# Altium project Multi LT circuit.PrjPcb
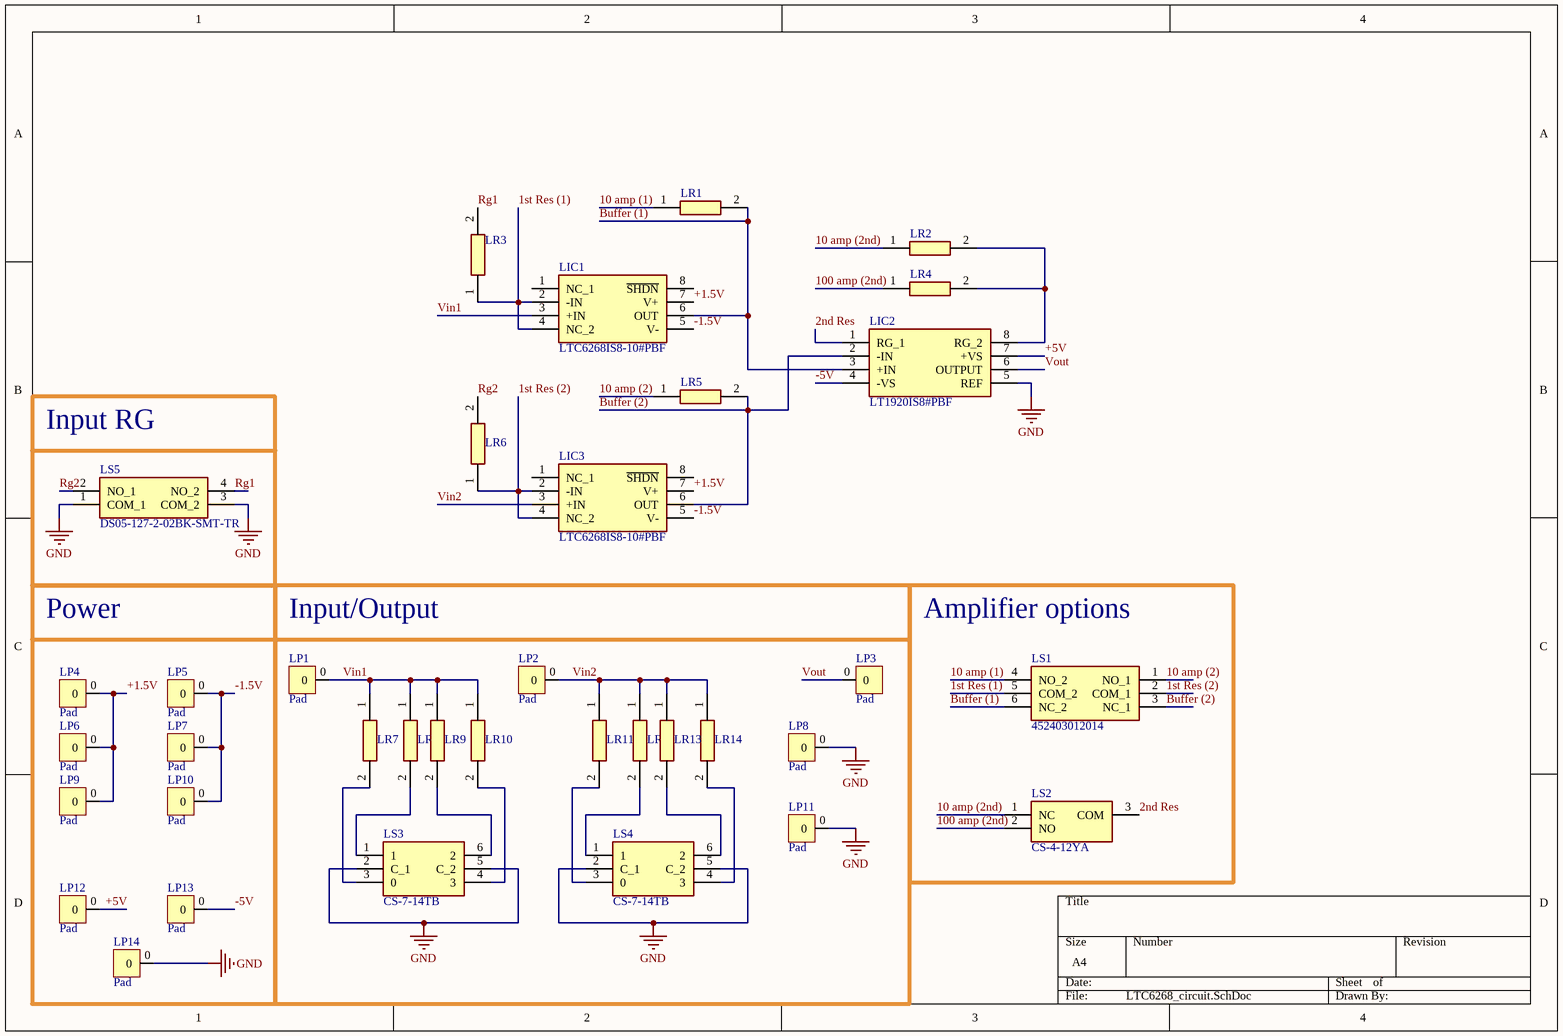
[diagram p0: LTC6268_circuit.SchDoc]
3 sheets, 189 parts. Net scope: global (net labels, ports and power ports of the same name join across sheets).
Board files: LTC6268_PCB.PcbDoc, Multi_LT_PCB.PcbDoc, AD8065_PCB.PcbDoc, Panelize_PCB.PcbDoc
Sheets:
  LTC6268_circuit.SchDoc
  Multi_LT_circuit.SchDoc
  AD8065_circuit.SchDoc

## Sheet LTC6268_circuit.SchDoc
size A4; SheetNumber: 1; SheetTotal: 1

### Parts
LIC1  LTC6268IS8-10#PBF  [SOIC127P599X175-8N]
LIC2  LT1920IS8#PBF  [SOIC127P599X175-8N]
LIC3  LTC6268IS8-10#PBF  [SOIC127P599X175-8N]
LP1  Pad  [Pad]
LP2  Pad  [Pad]
LP3  Pad  [Pad]
LP4  Pad  [Pad]
LP5  Pad  [Pad]
LP6  Pad  [Pad]
LP7  Pad  [Pad]
LP8  Pad  [Pad]
LP9  Pad  [Pad]
LP10  Pad  [Pad]
LP11  Pad  [Pad]
LP12  Pad  [Pad]
LP13  Pad  [Pad]
LP14  Pad  [Pad]
LR1  CRG0805F270R  [RESC2012X65N]  (value not drawn)
LR2  CRG0805F4K7  [RESC2012X65N]  (value not drawn)
LR3  ERJ-HP6F20R0V  [ERJHP6D1000V]  (value not drawn)
LR4  CRG0805F330R  [RESC2012X65N]  (value not drawn)
LR5  CRG0805F270R  [RESC2012X65N]  (value not drawn)
LR6  ERJ-HP6F20R0V  [ERJHP6D1000V]  (value not drawn)
LR7  RH73X2A10GNTN  [RESC2013X50N]  (value not drawn)
LR8  RH73X2A50GNTN  [RESC2013X50N]  (value not drawn)
LR9  RH73H2A100MKTN  [RESC2013X50N]  (value not drawn)
LR10  RH73W2A1GNTN  [RESC2013X50N]  (value not drawn)
LR11  RH73X2A50GNTN  [RESC2013X50N]  (value not drawn)
LR12  RH73X2A10GNTN  [RESC2013X50N]  (value not drawn)
LR13  RH73W2A1GNTN  [RESC2013X50N]  (value not drawn)
LR14  RH73H2A100MKTN  [RESC2013X50N]  (value not drawn)
LS1  452403012014  [452403012014]
LS2  CS-4-12YA  [CS412YA]
LS3  CS-7-14TB  [SOP254P1000X405-6N]
LS4  CS-7-14TB  [SOP254P1000X405-6N]
LS5  DS05-127-2-02BK-SMT-TR  [DS05127202BKSMTTR]

### Blocks framed on the sheet
Input RG: LS5
Power: LP4-LP7 LP9 LP10 LP12-LP14
Input/Output: LP1-LP3 LP8 LP11 LR7-LR14 LS3 LS4
Amplifier options: LS1 LS2

### Nets
GND: LIC2.5(REF) LP8.0 LP11.0 LP14.0 LS3.2(C_1) LS3.5(C_2) LS4.2(C_1) LS4.5(C_2) LS5.1(COM_1) LS5.3(COM_2)
1st Res (1): LIC1.2(-IN) LIC1.4(NC_2) LR3.1 LS1.5(COM_2)
1st Res (2): LIC3.2(-IN) LIC3.4(NC_2) LR6.1 LS1.2(COM_1)
2nd Res: LIC2.1(RG_1) LS2.3(COM)
10 amp (1): LR1.1 LS1.4(NO_2)
10 amp (2): LR5.1 LS1.1(NO_1)
10 amp (2nd): LR2.1 LS2.1(NC)
100 amp (2nd): LR4.1 LS2.2(NO)
+1.5V: LIC1.7(V+) LIC3.7(V+) LP4.0 LP6.0 LP9.0
+5V: LIC2.7(+VS) LP12.0
-1.5V: LIC1.5(V-) LIC3.5(V-) LP5.0 LP7.0 LP10.0
-5V: LIC2.4(-VS) LP13.0
Buffer (1): LIC1.6(OUT) LIC2.3(+IN) LR1.2 LS1.6(NC_2)
Buffer (2): LIC2.2(-IN) LIC3.6(OUT) LR5.2 LS1.3(NC_1)
Rg1: LR3.2 LS5.4(NO_2)
Rg2: LR6.2 LS5.2(NO_1)
Vin1: LIC1.3(+IN) LP1.0 LR7.1 LR8.1 LR9.1 LR10.1
Vin2: LIC3.3(+IN) LP2.0 LR11.1 LR12.1 LR13.1 LR14.1
Vout: LIC2.6(OUTPUT) LP3.0
NetLIC2_8: LIC2.8(RG_2) LR2.2 LR4.2
NetLR7_2: LR7.2 LS3.3(0)
NetLR8_2: LR8.2 LS3.1
NetLR9_2: LR9.2 LS3.6(2)
NetLR10_2: LR10.2 LS3.4(3)
NetLR11_2: LR11.2 LS4.3(0)
NetLR12_2: LR12.2 LS4.1
NetLR13_2: LR13.2 LS4.6(2)
NetLR14_2: LR14.2 LS4.4(3)

Not connected (* = marked no-connect by the designer): LIC1 1(NC_1) 8(~{SHDN}); LIC3 1(NC_1) 8(~{SHDN})

### Library data of the parts
LIC1 LIC3 = LTC6268IS8-10#PBF: Integrated Circuit; Manufacturer_Name: Analog Devices; Datasheet Link: https://datasheet.datasheetarchive.com/originals/distributors/Datasheets_SAMA/eb0bf5824ac521a4901f543e1202dae7.pdf; Height: 1.752mm; Manufacturer_Part_Number: LTC6268IS8-10#PBF; Mouser Part Number: 584-LTC6268IS8-10PBF; Mouser Price/Stock: https://www.mouser.co.uk/ProductDetail/Analog-Devices/LTC6268IS8-10PBF?qs=oahfZPh6IAJW%252BkNj5oLlfA%3D%3D; Arrow Part Number: LTC6268IS8-10#PBF; Arrow Price/Stock: https://www.arrow.com/en/products/ltc6268is8-10pbf/analog-devices?region=nac; Case: SOIC-8; Mounting Style: SMD/SMT
LIC2 = LT1920IS8#PBF: Integrated Circuit; Manufacturer_Name: Analog Devices; Datasheet Link: https://datasheet.datasheetarchive.com/originals/distributors/SFDatasheet-4/sf-00091026.pdf; Height: 1.752mm; Manufacturer_Part_Number: LT1920IS8#PBF; Mouser Part Number: 584-LT1920IS8#PBF; Mouser Price/Stock: https://www.mouser.co.uk/ProductDetail/Analog-Devices/LT1920IS8PBF?qs=ytflclh7QUWOSod6PqfjSg%3D%3D; Arrow Part Number: LT1920IS8#PBF; Arrow Price/Stock: https://www.arrow.com/en/products/lt1920is8pbf/analog-devices?region=nac; Case: SOIC-8; Mounting Style: SMD/SMT
LR1 LR5 = CRG0805F270R: Resistor 270; Manufacturer_Name: TE Connectivity; Datasheet Link: http://www.te.com/commerce/DocumentDelivery/DDEController?Action=showdoc&DocId=Customer+Drawing%7F1623109%7FBA%7Fpdf%7FEnglish%7FENG_CD_1623109_BA.pdf%7F1623109-1; Height: 0.65mm; Manufacturer_Part_Number: CRG0805F270R; Mouser Part Number: 279-CRG0805F270R; Mouser Price/Stock: https://www.mouser.com/Search/Refine.aspx?Keyword=279-CRG0805F270R; Arrow Part Number: CRG0805F270R; Arrow Price/Stock: https://www.arrow.com/en/products/crg0805f270r/te-connectivity; Case: 0805 (in); Mounting Style: SMD/SMT
LR2 = CRG0805F4K7: Resistor 4.7k; Manufacturer_Name: TE Connectivity; Datasheet Link: http://www.te.com/commerce/DocumentDelivery/DDEController?Action=showdoc&DocId=Customer+Drawing%7F1623109%7FBA%7Fpdf%7FEnglish%7FENG_CD_1623109_BA.pdf%7F1623109-1; Height: 0.65mm; Manufacturer_Part_Number: CRG0805F4K7; Mouser Part Number: 279-CRG0805F4K7; Mouser Price/Stock: https://www.mouser.co.uk/ProductDetail/TE-Connectivity-Holsworthy/CRG0805F4K7?qs=VHcS2MTj4gYTCl8bEMP1DQ%3D%3D; Arrow Part Number: CRG0805F4K7; Arrow Price/Stock: https://www.arrow.com/en/products/crg0805f4k7/te-connectivity?region=nac; Case: 0805 (in); Mounting Style: SMD/SMT
LR3 LR6 = ERJ-HP6F20R0V: Resistor 20; Manufacturer_Name: Panasonic; Datasheet Link: http://industrial.panasonic.com/cdbs/www-data/pdf/RDQ0000/ast-ind-151033.pdf; Height: 0.7mm; Manufacturer_Part_Number: ERJ-HP6F20R0V
LR4 = CRG0805F330R: Resistor 330; Manufacturer_Name: TE Connectivity; Datasheet Link: http://www.te.com/commerce/DocumentDelivery/DDEController?Action=showdoc&DocId=Customer+Drawing%7F1623109%7FBA%7Fpdf%7FEnglish%7FENG_CD_1623109_BA.pdf%7F1623109-1; Height: 0.65mm; Manufacturer_Part_Number: CRG0805F330R; Mouser Part Number: 279-CRG0805F330R; Mouser Price/Stock: https://www.mouser.co.uk/ProductDetail/TE-Connectivity-Holsworthy/CRG0805F330R?qs=VHcS2MTj4gbLzLJ0%2FI3gmA%3D%3D; Arrow Part Number: CRG0805F330R; Arrow Price/Stock: https://www.arrow.com/en/products/crg0805f330r/te-connectivity?region=nac; Case: 0805 (in); Mounting Style: SMD/SMT
LR7 LR12 = RH73X2A10GNTN: Resistor 10G; Manufacturer_Name: TE Connectivity; Datasheet Link: https://ms.componentsearchengine.com/Datasheets/2/RH73X2A10GNTN.pdf; Height: 0.5mm; Manufacturer_Part_Number: RH73X2A10GNTN; Mouser Part Number: 279-RH73X2A10GNTN; Mouser Price/Stock: https://www.mouser.co.uk/ProductDetail/TE-Connectivity-Holsworthy/RH73X2A10GNTN?qs=ip69W3eHERU7YDrLGqSvdQ%3D%3D; Arrow Part Number: RH73X2A10GNTN; Arrow Price/Stock: https://www.arrow.com/en/products/rh73x2a10gntn/te-connectivity?region=nac; Case: 0805 (in); Mounting Style: SMD/SMT
LR8 LR11 = RH73X2A50GNTN: Resistor 50G; Manufacturer_Name: TE Connectivity; Datasheet Link: http://www.te.com/commerce/DocumentDelivery/DDEController?Action=showdoc&DocId=Data+Sheet%7F1773268%7FA%7Fpdf%7FEnglish%7FENG_DS_1773268_A.pdf%7F1625862-4; Height: 0.5mm; Manufacturer_Part_Number: RH73X2A50GNTN; Mouser Part Number: 279-RH73X2A50GNTN; Mouser Price/Stock: https://www.mouser.co.uk/ProductDetail/TE-Connectivity-Holsworthy/RH73X2A50GNTN?qs=ip69W3eHERVWqEnkYPnkdA%3D%3D; Case: 0805 (in); Mounting Style: SMD/SMT
LR9 LR14 = RH73H2A100MKTN: Resistor 100M; Manufacturer_Name: TE Connectivity; Datasheet Link: http://www.te.com/commerce/DocumentDelivery/DDEController?Action=showdoc&DocId=Data+Sheet%7F1773268%7FA%7Fpdf%7FEnglish%7FENG_DS_1773268_A.pdf%7F1625856-2; Height: 0.5mm; Manufacturer_Part_Number: RH73H2A100MKTN; Mouser Part Number: 279-RH73H2A100MKTN; Mouser Price/Stock: https://www.mouser.co.uk/ProductDetail/TE-Connectivity-Holsworthy/RH73H2A100MKTN?qs=ip69W3eHERW4mrE8f49Fxw%3D%3D; Arrow Part Number: RH73H2A100MKTN; Arrow Price/Stock: https://www.arrow.com/en/products/rh73h2a100mktn/te-connectivity?region=nac; Case: 0805 (in); Mounting Style: SMD/SMT
LR10 LR13 = RH73W2A1GNTN: Resistor 1G; Manufacturer_Name: TE Connectivity; Datasheet Link: https://componentsearchengine.com/Datasheets/2/RH73W2A1GNTN.pdf; Height: 0.5mm; Manufacturer_Part_Number: RH73W2A1GNTN; Mouser Part Number: 279-RH73W2A1GNTN; Mouser Price/Stock: https://www.mouser.co.uk/ProductDetail/TE-Connectivity-Holsworthy/RH73W2A1GNTN?qs=ip69W3eHERV4S8tLXHYflA%3D%3D; Arrow Part Number: RH73W2A1GNTN; Arrow Price/Stock: https://www.arrow.com/en/products/rh73w2a1gntn/te-connectivity?region=nac; Case: 0805 (in); Mounting Style: SMD/SMT
LS1 = 452403012014: Switch; Manufacturer_Name: Wurth Elektronik; Datasheet Link: https://katalog.we-online.de/em/datasheet/452403012014.pdf; Height: 3.3mm; Manufacturer_Part_Number: 452403012014; Mouser Part Number: 710-452403012014; Mouser Price/Stock: https://www.mouser.co.uk/ProductDetail/Wurth-Elektronik/452403012014?qs=DvsTirrhYfOi0QxHyAEO3w%3D%3D
LS2 = CS-4-12YA: Switch; Manufacturer_Name: NIDEC COPAL; Datasheet Link: https://www.nidec-copal-electronics.com/j/product/detail/00000197/; Height: 2.6mm; Manufacturer_Part_Number: CS-4-12YA; Mounting Style: SMD/SMT
LS3 LS4 = CS-7-14TB: Switch; Manufacturer_Name: Copal Electronics; Datasheet Link: https://www.nidec-copal-electronics.com/e/catalog/switch/cs-7.pdf; Height: 4.05mm; Manufacturer_Part_Number: CS-7-14TB; Mounting Style: SMD/SMT
LS5 = DS05-127-2-02BK-SMT-TR: Switch; Manufacturer_Name: CUI Devices; Datasheet Link: https://www.cuidevices.com/product/resource/digikeypdf/ds05-127-smt.pdf; Height: 2.6mm; Manufacturer_Part_Number: DS05-127-2-02BK-SMT-TR; Mouser Part Number: 490-DS05127202BK-STR; Mouser Price/Stock: https://www.mouser.co.uk/ProductDetail/CUI-Devices/DS05-127-2-02BK-SMT-TR?qs=wnTfsH77Xs6TIyf6yhikhg%3D%3D; Mounting Style: SMD/SMT

## Sheet Multi_LT_circuit.SchDoc
size A3; SheetNumber: 3; SheetTotal: 3
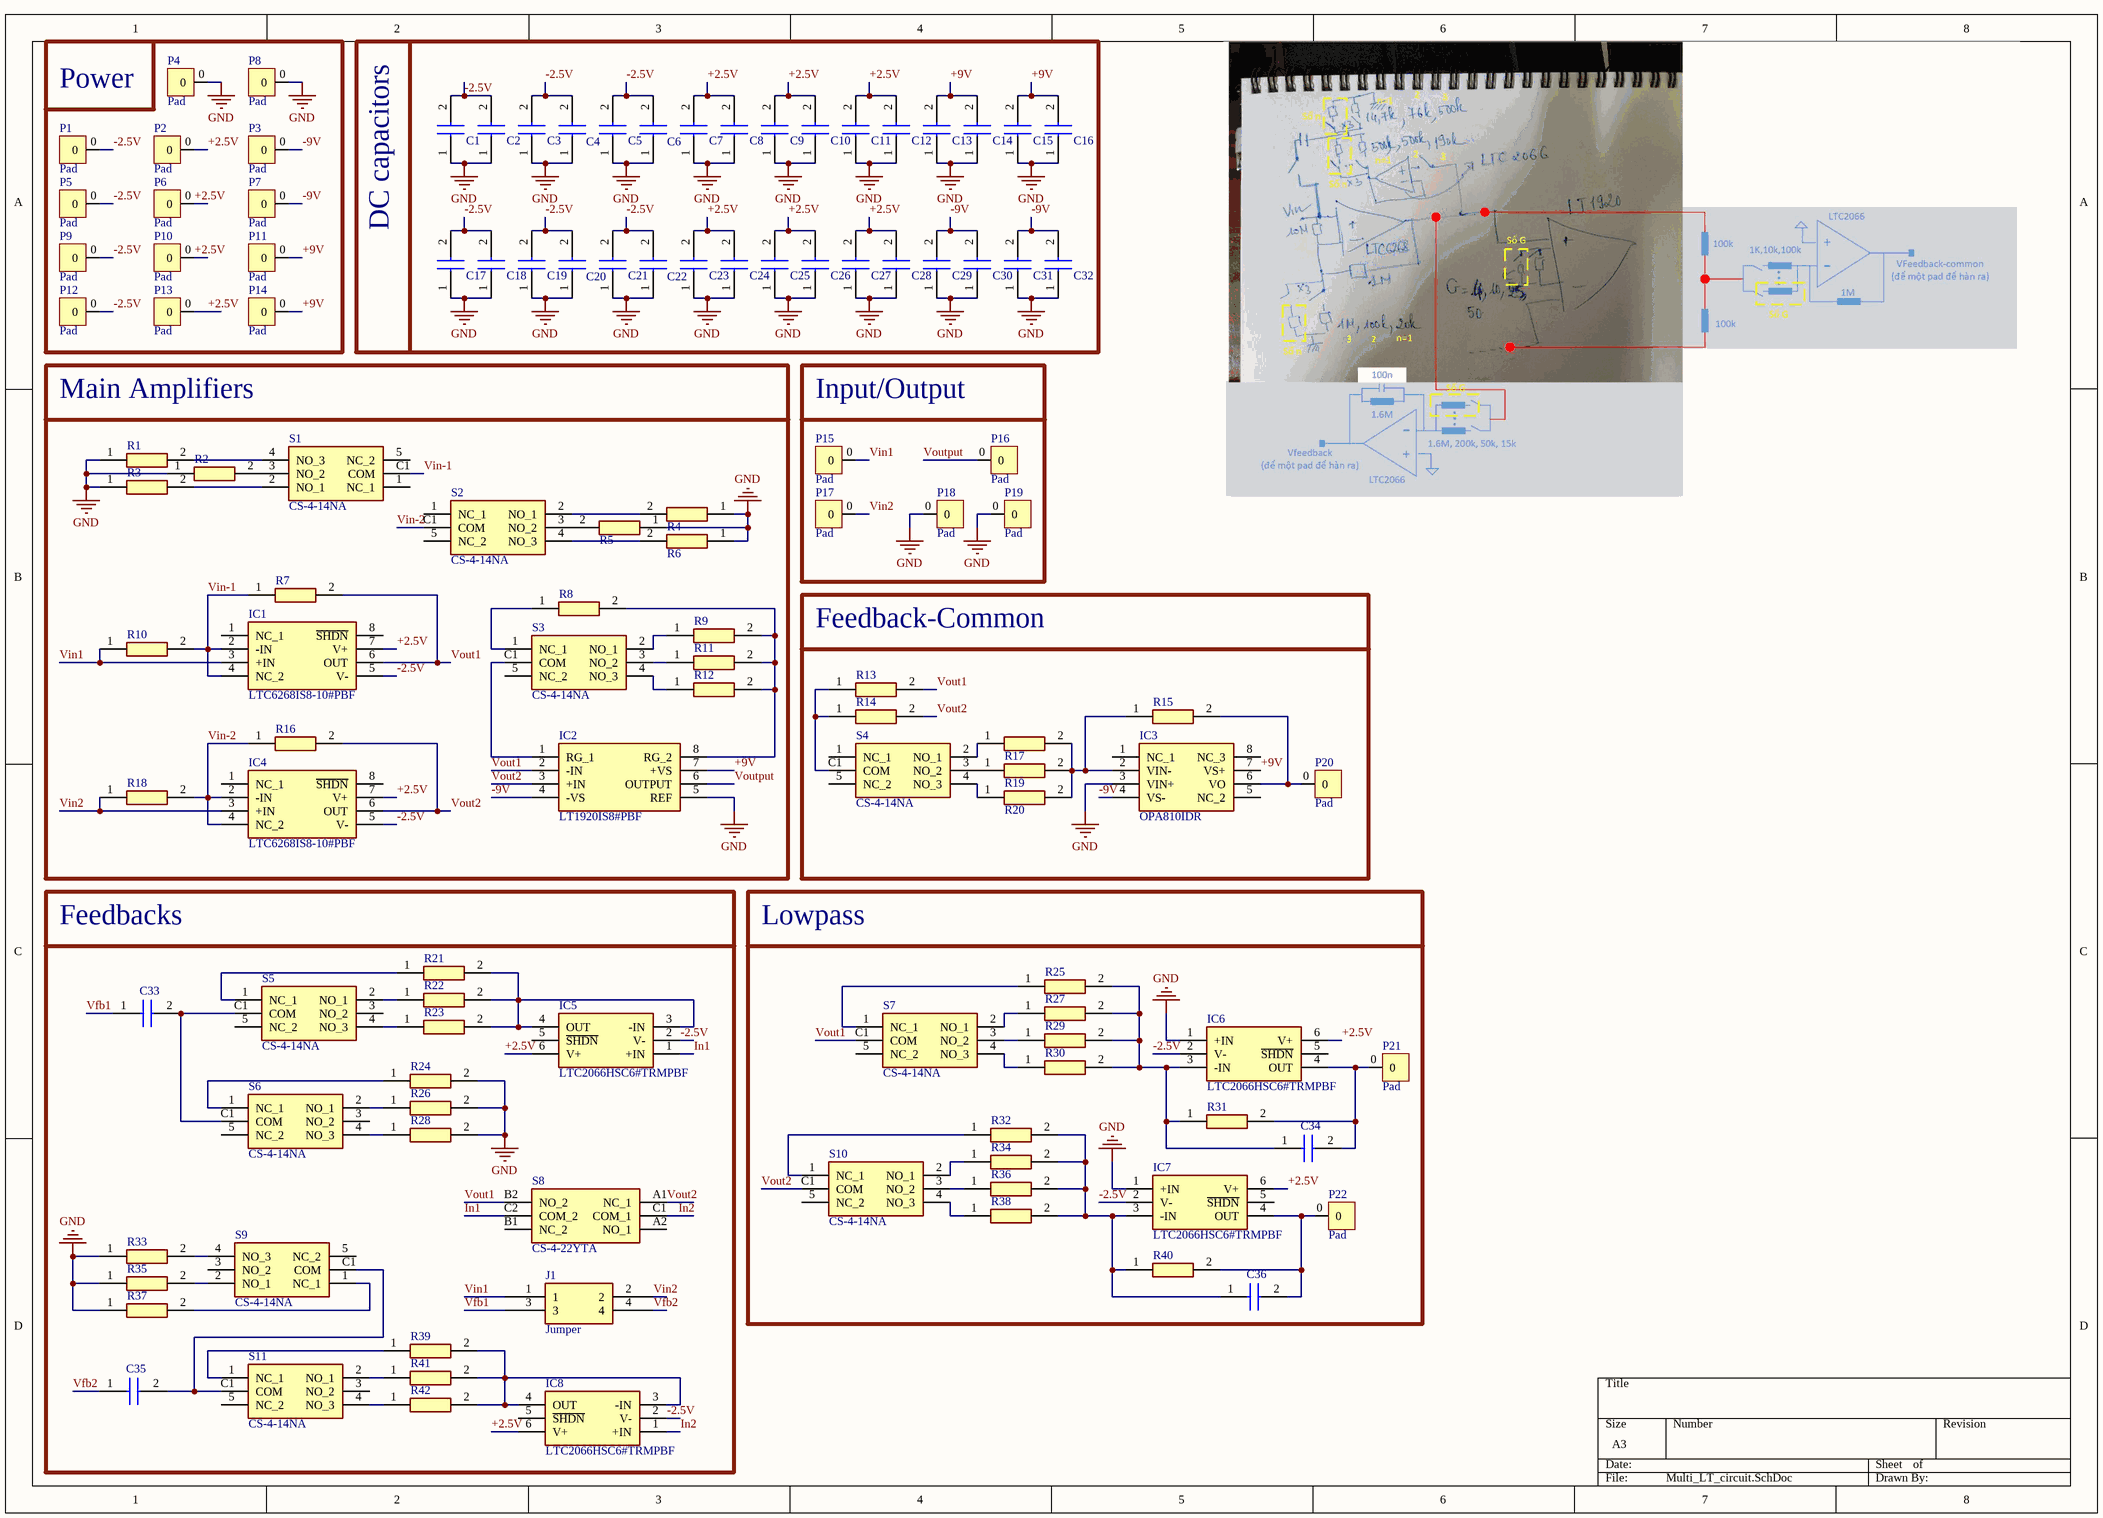
[diagram p1: Multi_LT_circuit.SchDoc]

### Parts
C1  GCM21BD70J106KE02K  [CAPC2012X140N]  (value not drawn)
C2  GCJ21BR72A104KA01K  [CAPC2012X150N]  (value not drawn)
C3  GCM21BD70J106KE02K  [CAPC2012X140N]  (value not drawn)
C4  GCJ21BR72A104KA01K  [CAPC2012X150N]  (value not drawn)
C5  GCM21BD70J106KE02K  [CAPC2012X140N]  (value not drawn)
C6  GCJ21BR72A104KA01K  [CAPC2012X150N]  (value not drawn)
C7  GCM21BD70J106KE02K  [CAPC2012X140N]  (value not drawn)
C8  GCJ21BR72A104KA01K  [CAPC2012X150N]  (value not drawn)
C9  GCM21BD70J106KE02K  [CAPC2012X140N]  (value not drawn)
C10  GCJ21BR72A104KA01K  [CAPC2012X150N]  (value not drawn)
C11  GCM21BD70J106KE02K  [CAPC2012X140N]  (value not drawn)
C12  GCJ21BR72A104KA01K  [CAPC2012X150N]  (value not drawn)
C13  GCM21BD70J106KE02K  [CAPC2012X140N]  (value not drawn)
C14  GCJ21BR72A104KA01K  [CAPC2012X150N]  (value not drawn)
C15  GCM21BD70J106KE02K  [CAPC2012X140N]  (value not drawn)
C16  GCJ21BR72A104KA01K  [CAPC2012X150N]  (value not drawn)
C17  GCM21BD70J106KE02K  [CAPC2012X140N]  (value not drawn)
C18  GCJ21BR72A104KA01K  [CAPC2012X150N]  (value not drawn)
C19  GCM21BD70J106KE02K  [CAPC2012X140N]  (value not drawn)
C20  GCJ21BR72A104KA01K  [CAPC2012X150N]  (value not drawn)
C21  GCM21BD70J106KE02K  [CAPC2012X140N]  (value not drawn)
C22  GCJ21BR72A104KA01K  [CAPC2012X150N]  (value not drawn)
C23  GCM21BD70J106KE02K  [CAPC2012X140N]  (value not drawn)
C24  GCJ21BR72A104KA01K  [CAPC2012X150N]  (value not drawn)
C25  GCM21BD70J106KE02K  [CAPC2012X140N]  (value not drawn)
C26  GCJ21BR72A104KA01K  [CAPC2012X150N]  (value not drawn)
C27  GCM21BD70J106KE02K  [CAPC2012X140N]  (value not drawn)
C28  GCJ21BR72A104KA01K  [CAPC2012X150N]  (value not drawn)
C29  GCM21BD70J106KE02K  [CAPC2012X140N]  (value not drawn)
C30  GCJ21BR72A104KA01K  [CAPC2012X150N]  (value not drawn)
C31  GCM21BD70J106KE02K  [CAPC2012X140N]  (value not drawn)
C32  GCJ21BR72A104KA01K  [CAPC2012X150N]  (value not drawn)
C33  C0805C109B3GACTU  [C0805]  (value not drawn)
C34  GCJ21BR72A104KA01K  [CAPC2012X150N]  (value not drawn)
C35  C0805C109B3GACTU  [C0805]  (value not drawn)
C36  GCJ21BR72A104KA01K  [CAPC2012X150N]  (value not drawn)
IC1  LTC6268IS8-10#PBF  [SOIC127P599X175-8N]
IC2  LT1920IS8#PBF  [SOIC127P599X175-8N]
IC3  OPA810IDR  [SOIC127P600X175-8N]
IC4  LTC6268IS8-10#PBF  [SOIC127P599X175-8N]
IC5  LTC2066HSC6#TRMPBF  [SOT65P210X100-6N]
IC6  LTC2066HSC6#TRMPBF  [SOT65P210X100-6N]
IC7  LTC2066HSC6#TRMPBF  [SOT65P210X100-6N]
IC8  LTC2066HSC6#TRMPBF  [SOT65P210X100-6N]
J1  Jumper  [Jumper 2x2]
P1  Pad  [Pad]
P2  Pad  [Pad]
P3  Pad  [Pad]
P4  Pad  [Pad]
P5  Pad  [Pad]
P6  Pad  [Pad]
P7  Pad  [Pad]
P8  Pad  [Pad]
P9  Pad  [Pad]
P10  Pad  [Pad]
P11  Pad  [Pad]
P12  Pad  [Pad]
P13  Pad  [Pad]
P14  Pad  [Pad]
P15  Pad  [Pad]
P16  Pad  [Pad]
P17  Pad  [Pad]
P18  Pad  [Pad]
P19  Pad  [Pad]
P20  Pad  [Pad]
P21  Pad  [Pad]
P22  Pad  [Pad]
R1  CRG0805F20K  [RESC2012X65N]  (value not drawn)
R2  CRG0805F100K  [RESC2012X65N]  (value not drawn)
R3  CRGH0805F1M0  [RESC2013X65N]  (value not drawn)
R4  CRG0805F20K  [RESC2012X65N]  (value not drawn)
R5  CRG0805F100K  [RESC2012X65N]  (value not drawn)
R6  CRGH0805F1M0  [RESC2013X65N]  (value not drawn)
R7  CRGH0805F1M0  [RESC2013X65N]  (value not drawn)
R8  CRGH0805F1K0  [RESC2013X65N]  (value not drawn)
R9  CRCW08052K05FKEA  [RESC2012X50N]  (value not drawn)
R10  CRGH0805J10M  [RESC2013X65N]  (value not drawn)
R11  CRCW08055K49FKEAHP  [RESC2012X60N]  (value not drawn)
R12  CRCW080516K5FKEA  [RESC2012X50N]  (value not drawn)
R13  CRG0805F100K  [RESC2012X65N]  (value not drawn)
R14  CRG0805F100K  [RESC2012X65N]  (value not drawn)
R15  CRGH0805F1M0  [RESC2013X65N]  (value not drawn)
R16  CRGH0805F1M0  [RESC2013X65N]  (value not drawn)
R17  CRG0805F100K  [RESC2012X65N]  (value not drawn)
R18  CRGH0805J10M  [RESC2013X65N]  (value not drawn)
R19  CRGH0805F10K  [RESC2013X65N]  (value not drawn)
R20  CRGH0805F1K0  [RESC2013X65N]  (value not drawn)
R21  CPF0805B499KE1  [RESC2012X65N]  (value not drawn)
R22  CPF0805B499KE1  [RESC2012X65N]  (value not drawn)
R23  CRGH0805F191K  [RESC2013X65N]  (value not drawn)
R24  CPF0805B499KE1  [RESC2012X65N]  (value not drawn)
R25  CPF0805B1M6E1  [RESC2012X65N]  (value not drawn)
R26  ERJ-6ENF7682V  [ERJ6ENF1000V]  (value not drawn)
R27  CPF-A-0805B200KE  [RESC2012X65N]  (value not drawn)
R28  CRCW080514K7FKEA  [RESC2012X50N]  (value not drawn)
R29  CPF-A-0805B49K9E1  [RESC2012X65N]  (value not drawn)
R30  CRGH0805F15K  [RESC2013X65N]  (value not drawn)
R31  CPF0805B1M6E1  [RESC2012X65N]  (value not drawn)
R32  CPF0805B1M6E1  [RESC2012X65N]  (value not drawn)
R33  CRCW080514K7FKEA  [RESC2012X50N]  (value not drawn)
R34  CPF-A-0805B200KE  [RESC2012X65N]  (value not drawn)
R35  ERJ-6ENF7682V  [ERJ6ENF1000V]  (value not drawn)
R36  CPF-A-0805B49K9E1  [RESC2012X65N]  (value not drawn)
R37  CPF0805B499KE1  [RESC2012X65N]  (value not drawn)
R38  CRGH0805F15K  [RESC2013X65N]  (value not drawn)
R39  CPF0805B499KE1  [RESC2012X65N]  (value not drawn)
R40  CPF0805B1M6E1  [RESC2012X65N]  (value not drawn)
R41  CPF0805B499KE1  [RESC2012X65N]  (value not drawn)
R42  CRGH0805F191K  [RESC2013X65N]  (value not drawn)
S1  CS-4-14NA  [CS414NA]
S2  CS-4-14NA  [CS414NA]
S3  CS-4-14NA  [CS414NA]
S4  CS-4-14NA  [CS414NA]
S5  CS-4-14NA  [CS414NA]
S6  CS-4-14NA  [CS414NA]
S7  CS-4-14NA  [CS414NA]
S8  CS-4-22YTA  [CS422YTA]
S9  CS-4-14NA  [CS414NA]
S10  CS-4-14NA  [CS414NA]
S11  CS-4-14NA  [CS414NA]

### Blocks framed on the sheet
Power: P1-P14
DC capacitors: C1-C32
Main Amplifiers: IC1 IC2 IC4 R1-R12 R16 R18 S1-S3
Input/Output: P15-P19
Feedback-Common: IC3 P20 R13-R15 R17 R19 R20 S4
Feedbacks: C33 C35 IC5 IC8 J1 R21-R24 R26 R28 R33 R35 R37 R39 R41 R42 S5 S6 S8 S9 S11
Lowpass: C34 C36 IC6 IC7 P21 P22 R25 R27 R29-R32 R34 R36 R38 R40 S7 S10

### Nets
GND: C1.1 C2.1 C3.1 C4.1 C5.1 C6.1 C7.1 C8.1 C9.1 C10.1 C11.1 C12.1 C13.1 C14.1 C15.1 C16.1 C17.1 C18.1 C19.1 C20.1 C21.1 C22.1 C23.1 C24.1 C25.1 C26.1 C27.1 C28.1 C29.1 C30.1 C31.1 C32.1 IC2.5(REF) IC3.3(VIN+) IC6.1(+IN) IC7.1(+IN) P4.0 P8.0 P18.0 P19.0 R1.1 R2.1 R3.1 R4.1 R5.1 R6.1 R24.2 R26.2 R28.2 R33.1 R35.1 R37.1
+2.5V: C7.2 C8.2 C9.2 C10.2 C11.2 C12.2 C23.2 C24.2 C25.2 C26.2 C27.2 C28.2 IC1.7(V+) IC4.7(V+) IC5.6(V+) IC6.6(V+) IC7.6(V+) IC8.6(V+) P2.0 P6.0 P10.0 P13.0
+9V: C13.2 C14.2 C15.2 C16.2 IC2.7(+VS) IC3.7(VS+) P11.0 P14.0
-2.5V: C1.2 C2.2 C3.2 C4.2 C5.2 C6.2 C17.2 C18.2 C19.2 C20.2 C21.2 C22.2 IC1.5(V-) IC4.5(V-) IC5.2(V-) IC6.2(V-) IC7.2(V-) IC8.2(V-) P1.0 P5.0 P9.0 P12.0
-9V: C29.2 C30.2 C31.2 C32.2 IC2.4(-VS) IC3.4(VS-) P3.0 P7.0
In1: IC5.1(+IN) S8.C2(COM_2)
In2: IC8.1(+IN) S8.C1(COM_1)
Vfb1: C33.1 J1.3
Vfb2: C35.1 J1.4
Vin1: IC1.3(+IN) J1.1 P15.0 R10.1
Vin2: IC4.3(+IN) J1.2 P17.0 R18.1
Vin-1: IC1.2(-IN) IC1.4(NC_2) R7.1 R10.2 S1.C1(COM)
Vin-2: IC4.2(-IN) IC4.4(NC_2) R16.1 R18.2 S2.C1(COM)
Vout1: IC1.6(OUT) IC2.2(-IN) R7.2 R13.2 S7.C1(COM) S8.B2(NO_2)
Vout2: IC2.3(+IN) IC4.6(OUT) R14.2 R16.2 S8.A1(NC_1) S10.C1(COM)
Voutput: IC2.6(OUTPUT) P16.0
NetC33_2: C33.2 S5.C1(COM) S6.C1(COM)
NetC34_1: C34.1 IC6.3(-IN) R25.2 R27.2 R29.2 R30.2 R31.1
NetC34_2: C34.2 IC6.4(OUT) P21.0 R31.2
NetC35_2: C35.2 S9.C1(COM) S11.C1(COM)
NetC36_1: C36.1 IC7.3(-IN) R32.2 R34.2 R36.2 R38.2 R40.1
NetC36_2: C36.2 IC7.4(OUT) P22.0 R40.2
NetIC2_1: IC2.1(RG_1) S3.C1(COM)
NetIC2_8: IC2.8(RG_2) R8.2 R9.2 R11.2 R12.2
NetIC3_2: IC3.2(VIN-) R15.1 R17.2 R19.2 R20.2
NetIC3_6: IC3.6(VO) P20.0 R15.2
NetIC5_3: IC5.3(-IN) IC5.4(OUT) R21.2 R22.2 R23.2
NetIC8_3: IC8.3(-IN) IC8.4(OUT) R39.2 R41.2 R42.2
NetR1_2: R1.2 S1.4(NO_3)
NetR2_2: R2.2 S1.3(NO_2)
NetR3_2: R3.2 S1.2(NO_1)
NetR4_2: R4.2 S2.2(NO_1)
NetR5_2: R5.2 S2.3(NO_2)
NetR6_2: R6.2 S2.4(NO_3)
NetR8_1: R8.1 S3.1(NC_1)
NetR9_1: R9.1 S3.2(NO_1)
NetR11_1: R11.1 S3.3(NO_2)
NetR12_1: R12.1 S3.4(NO_3)
NetR13_1: R13.1 R14.1 S4.C1(COM)
NetR17_1: R17.1 S4.2(NO_1)
NetR19_1: R19.1 S4.3(NO_2)
NetR20_1: R20.1 S4.4(NO_3)
NetR21_1: R21.1 S5.1(NC_1)
NetR22_1: R22.1 S5.2(NO_1)
NetR23_1: R23.1 S5.4(NO_3)
NetR24_1: R24.1 S6.1(NC_1)
NetR25_1: R25.1 S7.1(NC_1)
NetR26_1: R26.1 S6.2(NO_1)
NetR27_1: R27.1 S7.2(NO_1)
NetR28_1: R28.1 S6.4(NO_3)
NetR29_1: R29.1 S7.3(NO_2)
NetR30_1: R30.1 S7.4(NO_3)
NetR32_1: R32.1 S10.1(NC_1)
NetR33_2: R33.2 S9.4(NO_3)
NetR34_1: R34.1 S10.2(NO_1)
NetR35_2: R35.2 S9.2(NO_1)
NetR36_1: R36.1 S10.3(NO_2)
NetR37_2: R37.2 S9.1(NC_1)
NetR38_1: R38.1 S10.4(NO_3)
NetR39_1: R39.1 S11.1(NC_1)
NetR41_1: R41.1 S11.2(NO_1)
NetR42_1: R42.1 S11.4(NO_3)

Not connected (* = marked no-connect by the designer): IC1 1(NC_1) 8(~{SHDN}); IC3 1(NC_1) 5(NC_2) 8(NC_3); IC4 1(NC_1) 8(~{SHDN}); IC5 5(~{SHDN}); IC6 5(~{SHDN}); IC7 5(~{SHDN}); IC8 5(~{SHDN}); S1 1(NC_1) 5(NC_2); S2 1(NC_1) 5(NC_2); S3 5(NC_2); S4 1(NC_1) 5(NC_2); S5 3(NO_2) 5(NC_2); S6 3(NO_2) 5(NC_2); S7 5(NC_2); S8 A2(NO_1) B1(NC_2); S9 3(NO_2) 5(NC_2); S10 5(NC_2); S11 3(NO_2) 5(NC_2)

### Library data of the parts
C1 C3 C5 C7 C9 C11 C13 C15 C17 C19 C21 C23 C25 C27 C29 C31 = GCM21BD70J106KE02K: Capacitor 10uF; Manufacturer_Name: Murata Electronics; Datasheet Link: https://www.murata.com/en-global/api/pdfdownloadapi?cate=luCeramicCapacitorsSMD&partno=GCM21BD70J106KE02%23; Height: 1.4mm; Manufacturer_Part_Number: GCM21BD70J106KE02K; Mouser Part Number: 81-GCM21BD70J106KE2K; Mouser Price/Stock: https://www.mouser.co.uk/ProductDetail/Murata-Electronics/GCM21BD70J106KE02K?qs=ufv2HEpFn%252BR%2FX0aJNPDpRg%3D%3D; Case: 0805 (in); Mounting Style: SMD/SMT
C2 C4 C6 C8 C10 C12 C14 C16 C18 C20 C22 C24 C26 C28 C30 C32 C34 C36 = GCJ21BR72A104KA01K: Capacitor 0.1uF; Manufacturer_Name: Murata Electronics; Datasheet Link: https://psearch.en.murata.com/capacitor/product/GCJ21BR72A104KA01%23.html; Height: 1.5mm; Manufacturer_Part_Number: GCJ21BR72A104KA01K; Mouser Part Number: 81-GCJ21BR72A104KA01; Mouser Price/Stock: https://www.mouser.co.uk/ProductDetail/Murata-Electronics/GCJ21BR72A104KA01K?qs=yTuLhIm%2Fv1BqgzUieC0jrw%3D%3D; Arrow Part Number: GCJ21BR72A104KA01K; Arrow Price/Stock: https://www.arrow.com/en/products/gcj21br72a104ka01k/murata-manufacturing?region=europe; Case: 0805 (in); Mounting Style: SMD/SMT
C33 C35 = C0805C109B3GACTU: Capacitor 1pF; Manufacturer_Name: KEMET; Datasheet Link: https://content.kemet.com/datasheets/KEM_C1003_C0G_SMD.pdf; Height: 1.1mm; Manufacturer_Part_Number: C0805C109B3GACTU; Case: 0805 (in); Mounting Style: SMD/SMT
IC1 IC4 = LTC6268IS8-10#PBF: as LIC1 on sheet LTC6268_circuit; Datasheet Link: https://datasheet.datasheetarchive.com/originals/distributors/Datasheets_SAMA/eb0bf5824ac521a4901f543e1202dae7.pdf; Height: 1.752mm; Manufacturer_Part_Number: LTC6268IS8-10#PBF; Mouser Part Number: 584-LTC6268IS8-10PBF; Mouser Price/Stock: https://www.mouser.co.uk/ProductDetail/Analog-Devices/LTC6268IS8-10PBF?qs=oahfZPh6IAJW%252BkNj5oLlfA%3D%3D; Arrow Part Number: LTC6268IS8-10#PBF; Arrow Price/Stock: https://www.arrow.com/en/products/ltc6268is8-10pbf/analog-devices?region=nac; Case: SOIC-8; Mounting Style: SMD/SMT
IC2 = LT1920IS8#PBF: as LIC2 on sheet LTC6268_circuit; Datasheet Link: https://datasheet.datasheetarchive.com/originals/distributors/SFDatasheet-4/sf-00091026.pdf; Height: 1.752mm; Manufacturer_Part_Number: LT1920IS8#PBF; Mouser Part Number: 584-LT1920IS8#PBF; Mouser Price/Stock: https://www.mouser.co.uk/ProductDetail/Analog-Devices/LT1920IS8PBF?qs=ytflclh7QUWOSod6PqfjSg%3D%3D; Arrow Part Number: LT1920IS8#PBF; Arrow Price/Stock: https://www.arrow.com/en/products/lt1920is8pbf/analog-devices?region=nac; Case: SOIC-8; Mounting Style: SMD/SMT
IC3 = OPA810IDR: Integrated Circuit; Manufacturer_Name: Texas Instruments; Datasheet Link: https://www.ti.com/lit/ds/symlink/opa810.pdf; Height: 1.75mm; Manufacturer_Part_Number: OPA810IDR; Mouser Part Number: 595-OPA810IDR; Mouser Price/Stock: https://www.mouser.co.uk/ProductDetail/Texas-Instruments/OPA810IDR?qs=ToK3%2FczOkx8EaDuN35bMdg%3D%3D; Arrow Part Number: OPA810IDR; Arrow Price/Stock: https://www.arrow.com/en/products/opa810idr/texas-instruments?region=nac; Case: SOIC-8; Mounting Style: SMD/SMT
IC5-IC8 = LTC2066HSC6#TRMPBF: Integrated Circuit; Manufacturer_Name: Analog Devices; Datasheet Link: https://www.analog.com/media/en/technical-documentation/data-sheets/LTC2066-2067.pdf; Height: 1mm; Manufacturer_Part_Number: LTC2066HSC6#TRMPBF; Mouser Part Number: 584-LTC2066HSC6TRMPB; Mouser Price/Stock: https://www.mouser.co.uk/ProductDetail/Analog-Devices/LTC2066HSC6TRMPBF?qs=W0yvOO0ixfHn5Jrn%2FV4Xwg%3D%3D; Arrow Part Number: LTC2066HSC6#TRMPBF; Arrow Price/Stock: https://www.arrow.com/en/products/ltc2066hsc6trmpbf/analog-devices; Case: SC-70-6; Mounting Style: SMD/SMT
R1 R4 = CRG0805F20K: Resistor 20k; Manufacturer_Name: TE Connectivity; Parameter 1: SMD/SMT; Datasheet Link: http://www.te.com/commerce/DocumentDelivery/DDEController?Action=showdoc&DocId=Customer+Drawing%7F1623109%7FBA%7Fpdf%7FEnglish%7FENG_CD_1623109_BA.pdf%7F1623109-1; Height: 0.65mm; Manufacturer_Part_Number: CRG0805F20K; Mouser Part Number: 279-CRG0805F20K; Mouser Price/Stock: https://www.mouser.co.uk/ProductDetail/TE-Connectivity-Holsworthy/CRG0805F20K?qs=o1jQnaWw5FTLjD3rzUcvvQ%3D%3D; Case: 0805 (in)
R2 R5 R13 R14 R17 = CRG0805F100K: Resistor 100k; Manufacturer_Name: TE Connectivity; Datasheet Link: http://www.te.com/commerce/DocumentDelivery/DDEController?Action=showdoc&DocId=Customer+Drawing%7F1623109%7FBA%7Fpdf%7FEnglish%7FENG_CD_1623109_BA.pdf%7F1623109-1; Height: 0.65mm; Manufacturer_Part_Number: CRG0805F100K; Mouser Part Number: 279-CRG0805F100K; Mouser Price/Stock: https://www.mouser.co.uk/ProductDetail/TE-Connectivity-Holsworthy/CRG0805F100K?qs=VHcS2MTj4gaSH6styLNYqg%3D%3D; Arrow Part Number: CRG0805F100K; Arrow Price/Stock: https://www.arrow.com/en/products/crg0805f100k/te-connectivity?region=nac; Case: 0805 (in); Mounting Style: SMD/SMT
R3 R6 R7 R15 R16 = CRGH0805F1M0: Resistor 1M; Manufacturer_Name: TE Connectivity; Datasheet Link: http://docs-europe.electrocomponents.com/webdocs/12d7/0900766b812d7379.pdf; Height: 0.65mm; Manufacturer_Part_Number: CRGH0805F1M0; Mouser Part Number: 279-CRGH0805F1M0; Mouser Price/Stock: https://www.mouser.co.uk/ProductDetail/TE-Connectivity-Holsworthy/CRGH0805F1M0?qs=n4i9pByFsMQTrmSXKnTEpA%3D%3D; Arrow Part Number: CRGH0805F1M0; Arrow Price/Stock: https://www.arrow.com/en/products/crgh0805f1m0/te-connectivity; Case: 0805 (in); Mounting Style: SMD/SMT
R8 R20 = CRGH0805F1K0: Resistor 1k; Manufacturer_Name: TE Connectivity; Datasheet Link: http://docs-europe.electrocomponents.com/webdocs/12d7/0900766b812d7379.pdf; Height: 0.65mm; Manufacturer_Part_Number: CRGH0805F1K0; Mouser Part Number: 279-CRGH0805F1K0; Mouser Price/Stock: https://www.mouser.co.uk/ProductDetail/TE-Connectivity-Holsworthy/CRGH0805F1K0?qs=n4i9pByFsMSWm5mr6nHHgQ%3D%3D; Arrow Part Number: CRGH0805F1K0; Arrow Price/Stock: https://www.arrow.com/en/products/crgh0805f1k0/te-connectivity?region=nac; Case: 0805 (in); Mounting Style: SDM/SMT
R9 = CRCW08052K05FKEA: Resistor 2.05k; Manufacturer_Name: Vishay; Datasheet Link: http://www.vishay.com/docs/20035/dcrcwe3.pdf; Height: 0.5mm; Manufacturer_Part_Number: CRCW08052K05FKEA; Mouser Part Number: 71-CRCW0805-2.05K-E3; Case: 0805 (in); Mounting Style: SMD/SMT
R10 R18 = CRGH0805J10M: Resistor 10M; Manufacturer_Name: TE Connectivity; Datasheet Link: http://docs-europe.electrocomponents.com/webdocs/12d7/0900766b812d7379.pdf; Height: 0.65mm; Manufacturer_Part_Number: CRGH0805J10M; Mouser Part Number: 279-CRGH0805J10M; Mouser Price/Stock: https://www.mouser.co.uk/ProductDetail/TE-Connectivity-Holsworthy/CRGH0805J10M?qs=s1WWODT2SXVlIm5RdQkQ6A%3D%3D; Case: 0805 (in); Mounting Style: SMD/SMT
R11 = CRCW08055K49FKEAHP: Resistor 5.49k; Manufacturer_Name: Vishay; Datasheet Link: https://componentsearchengine.com/Datasheets/1/CRCW08051R00FKEAHP.pdf; Height: 0.6mm; Manufacturer_Part_Number: CRCW08055K49FKEAHP; Case: 0805 (in); Mounting Style: SMD/SMT
R12 = CRCW080516K5FKEA: Resistor 16.5k; Manufacturer_Name: Vishay; Datasheet Link: http://www.vishay.com/docs/20035/dcrcwe3.pdf; Height: 0.5mm; Manufacturer_Part_Number: CRCW080516K5FKEA; Mouser Part Number: 71-CRCW0805-16.5K-E3; Case: 0805 (in); Mounting Style: SMD/SMT
R19 = CRGH0805F10K: Resistor 10k; Manufacturer_Name: TE Connectivity; Datasheet Link: http://docs-europe.electrocomponents.com/webdocs/12d7/0900766b812d7379.pdf; Height: 0.65mm; Manufacturer_Part_Number: CRGH0805F10K; Mouser Part Number: 279-CRGH0805F10K; Mouser Price/Stock: https://www.mouser.co.uk/ProductDetail/TE-Connectivity-Holsworthy/CRGH0805F10K?qs=HLeXuo0aL2p58CY%2FK%252BmPjw%3D%3D; Arrow Part Number: CRGH0805F10K; Arrow Price/Stock: https://www.arrow.com/en/products/crgh0805f10k/te-connectivity; Case: 0805 (in); Mounting Style: SMD/SMT
R21 R22 R24 R37 R39 R41 = CPF0805B499KE1: Resistor 499k; Manufacturer_Name: TE Connectivity; Datasheet Link: http://docs-europe.electrocomponents.com/webdocs/13d1/0900766b813d116f.pdf; Height: 0.65mm; Manufacturer_Part_Number: CPF0805B499KE1; Mouser Part Number: 279-CPF0805B499KE1; Mouser Price/Stock: https://www.mouser.com/Search/Refine.aspx?Keyword=279-CPF0805B499KE1; Arrow Part Number: CPF0805B499KE1; Arrow Price/Stock: https://www.arrow.com/en/products/cpf0805b499ke1/te-connectivity; Case: 0805 (in); Mounting Style: SMD/SMT
R23 R42 = CRGH0805F191K: Resistor 191k; Manufacturer_Name: TE Connectivity; Datasheet Link: http://docs-europe.electrocomponents.com/webdocs/12d7/0900766b812d7379.pdf; Height: 0.65mm; Manufacturer_Part_Number: CRGH0805F191K; Mouser Part Number: 279-CRGH0805F191K; Mouser Price/Stock: https://www.mouser.co.uk/ProductDetail/TE-Connectivity-Neohm/CRGH0805F191K?qs=8G8kQhBkhGgT%2F02BvhuEeQ%3D%3D; Case: 0805 (in); Mounting Style: SMD/SMT
R25 R31 R32 R40 = CPF0805B1M6E1: Resistor 1.6M; Manufacturer_Name: TE Connectivity; Datasheet Link: http://docs-europe.electrocomponents.com/webdocs/13d1/0900766b813d116f.pdf; Height: 0.65mm; Manufacturer_Part_Number: CPF0805B1M6E1; Mouser Part Number: 279-CPF0805B1M6E1; Mouser Price/Stock: https://www.mouser.co.uk/ProductDetail/TE-Connectivity-Holsworthy/CPF0805B1M6E1?qs=5Dj%252BCDyFp7gud0VX0vRDmw%3D%3D; Case: 0805 (in); Mounting Style: SMD/SMT
R26 R35 = ERJ-6ENF7682V: Resistor 76.8k; Manufacturer_Name: Panasonic; Datasheet Link: https://industrial.panasonic.com/cdbs/www-data/pdf/RDA0000/AOA0000C84.pdf; Height: 0.7mm; Manufacturer_Part_Number: ERJ-6ENF7682V; Mouser Part Number: 667-ERJ-6ENF7682V; Mouser Price/Stock: https://www.mouser.com/Search/Refine.aspx?Keyword=667-ERJ-6ENF7682V; Case: 0805 (in); Mounting Style: SMD/SMT
R27 R34 = CPF-A-0805B200KE: Resistor 200k; Manufacturer_Name: TE Connectivity; Datasheet Link: https://www.mouser.in/datasheet/2/418/5/ENG_DS_1773200_1_A-847523.pdf; Height: 0.65mm; Manufacturer_Part_Number: CPF-A-0805B200KE; Mouser Part Number: 279-CPF-A-0805B200KE; Mouser Price/Stock: https://www.mouser.co.uk/ProductDetail/TE-Connectivity/CPF-A-0805B200KE?qs=chTDxNqvsympgoiwwdg80g%3D%3D; Case: 0805 (in); Mounting Style: SMD/SMT
R28 R33 = CRCW080514K7FKEA: Resistor 14.7k; Manufacturer_Name: Vishay; Datasheet Link: http://www.vishay.com/docs/20035/dcrcwe3.pdf; Height: 0.5mm; Manufacturer_Part_Number: CRCW080514K7FKEA; Mouser Part Number: 71-CRCW0805-14.7K-E3; Mouser Price/Stock: https://www.mouser.co.uk/ProductDetail/Vishay-Dale/CRCW080514K7FKEA?qs=bMjB6bAaLENHHnllsz%252BSXA%3D%3D; Arrow Part Number: CRCW080514K7FKEA; Arrow Price/Stock: https://www.arrow.com/en/products/crcw080514k7fkea/vishay?region=nac; Case: 0805 (in); Mounting Style: SMD/SMT
R29 R36 = CPF-A-0805B49K9E1: Resistor 49.9k; Manufacturer_Name: TE Connectivity; Datasheet Link: https://www.te.com/commerce/DocumentDelivery/DDEController?Action=showdoc&DocId=Data+Sheet%7F1773200-1%7FB%7Fpdf%7FEnglish%7FENG_DS_1773200-1_B.pdf%7F6-2176217-4; Height: 0.65mm; Manufacturer_Part_Number: CPF-A-0805B49K9E1; Mouser Part Number: 279-CPF-A0805B49K9E1; Mouser Price/Stock: https://www.mouser.vn/ProductDetail/TE-Connectivity-Holsworthy/CPF-A-0805B49K9E1?qs=sGAEpiMZZMtlubZbdhIBILA%2F3gb4ZcwrSl2lU3bSvkw%3D; Case: 0805 (in); Mounting Style: SMD/SMT
R30 R38 = CRGH0805F15K: Resistor 15k; Manufacturer_Name: TE Connectivity; Datasheet Link: http://docs-europe.electrocomponents.com/webdocs/12d7/0900766b812d7379.pdf; Height: 0.65mm; Manufacturer_Part_Number: CRGH0805F15K; Mouser Part Number: 279-CRGH0805F15K; Mouser Price/Stock: https://www.mouser.co.uk/ProductDetail/TE-Connectivity-Holsworthy/CRGH0805F15K?qs=n4i9pByFsMSabXcbjCkahQ%3D%3D; Case: 0805 (in); Mounting Style: SMD/SMT
S1-S7 S9-S11 = CS-4-14NA: Switch; Manufacturer_Name: Nidec Components; Datasheet Link: https://www.nidec-components.com/e/catalog/switch/cs-4.pdf; Height: 2.6mm; Manufacturer_Part_Number: CS-4-14NA; Mouser Part Number: 229-CS-4-14NA; Mouser Price/Stock: https://www.mouser.co.uk/ProductDetail/Nidec-Components/CS-4-14NA?qs=XeJtXLiO41SJhPXQmbZZMw%3D%3D; Mounting Style: SMD/SMT
S8 = CS-4-22YTA: Switch; Manufacturer_Name: Copal Electronics; Datasheet Link: https://www.nidec-copal-electronics.com/e/catalog/switch/cs-4.pdf; Height: 2.6mm; Manufacturer_Part_Number: CS-4-22YTA; Mouser Part Number: 229-CS-4-22YTA; Mouser Price/Stock: https://www.mouser.co.uk/ProductDetail/Nidec-Components/CS-4-22YTA?qs=XeJtXLiO41RMhjAhvBd3rw%3D%3D; Mounting Style: SMD/SMT

## Sheet AD8065_circuit.SchDoc
size A4; SheetNumber: 1; SheetTotal: 1
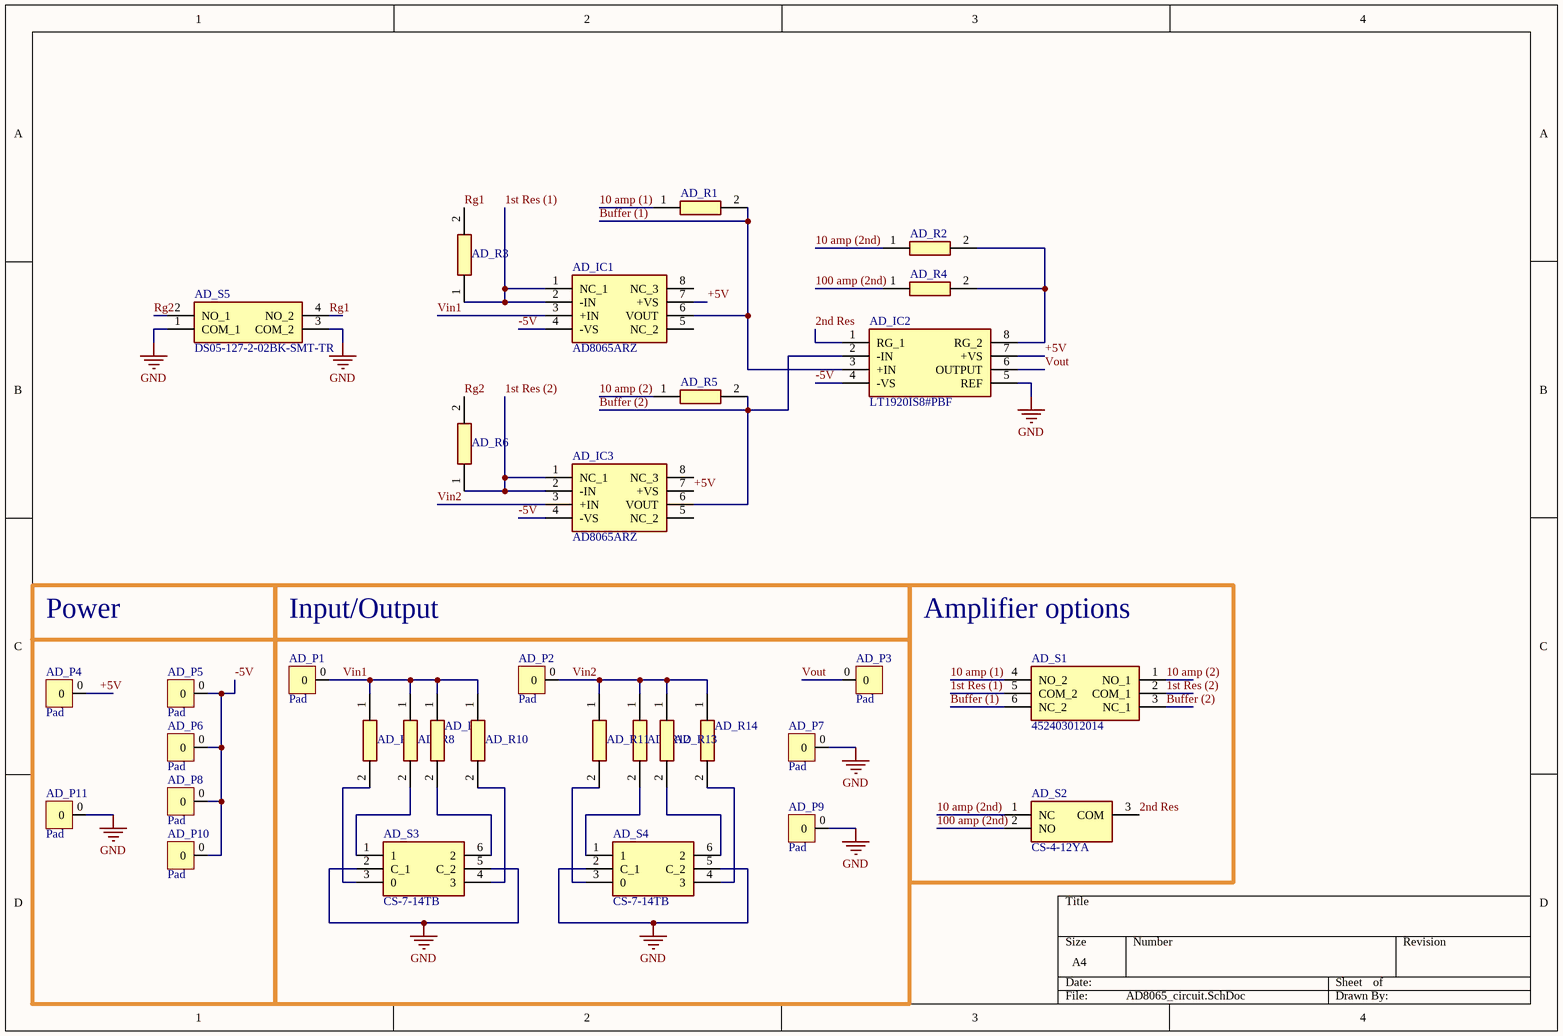
[diagram p2: AD8065_circuit.SchDoc]

### Parts
AD_IC1  AD8065ARZ  [SOIC127P600X175-8N]
AD_IC2  LT1920IS8#PBF  [SOIC127P599X175-8N]
AD_IC3  AD8065ARZ  [SOIC127P600X175-8N]
AD_P1  Pad  [Pad]
AD_P2  Pad  [Pad]
AD_P3  Pad  [Pad]
AD_P4  Pad  [Pad]
AD_P5  Pad  [Pad]
AD_P6  Pad  [Pad]
AD_P7  Pad  [Pad]
AD_P8  Pad  [Pad]
AD_P9  Pad  [Pad]
AD_P10  Pad  [Pad]
AD_P11  Pad  [Pad]
AD_R1  CRG0805F270R  [RESC2012X65N]  (value not drawn)
AD_R2  CRG0805F4K7  [RESC2012X65N]  (value not drawn)
AD_R3  ERJ-HP6F20R0V  [ERJHP6D1000V]  (value not drawn)
AD_R4  CRG0805F330R  [RESC2012X65N]  (value not drawn)
AD_R5  CRG0805F270R  [RESC2012X65N]  (value not drawn)
AD_R6  ERJ-HP6F20R0V  [ERJHP6D1000V]  (value not drawn)
AD_R7  RH73X2A10GNTN  [RESC2013X50N]  (value not drawn)
AD_R8  RH73X2A50GNTN  [RESC2013X50N]  (value not drawn)
AD_R9  RH73H2A100MKTN  [RESC2013X50N]  (value not drawn)
AD_R10  RH73W2A1GNTN  [RESC2013X50N]  (value not drawn)
AD_R11  RH73X2A50GNTN  [RESC2013X50N]  (value not drawn)
AD_R12  RH73X2A10GNTN  [RESC2013X50N]  (value not drawn)
AD_R13  RH73W2A1GNTN  [RESC2013X50N]  (value not drawn)
AD_R14  RH73H2A100MKTN  [RESC2013X50N]  (value not drawn)
AD_S1  452403012014  [452403012014]
AD_S2  CS-4-12YA  [CS412YA]
AD_S3  CS-7-14TB  [SOP254P1000X405-6N]
AD_S4  CS-7-14TB  [SOP254P1000X405-6N]
AD_S5  DS05-127-2-02BK-SMT-TR  [DS05127202BKSMTTR]

### Blocks framed on the sheet
Power: AD_P4-AD_P6 AD_P8 AD_P10 AD_P11
Input/Output: AD_P1-AD_P3 AD_P7 AD_P9 AD_R7-AD_R14 AD_S3 AD_S4
Amplifier options: AD_S1 AD_S2

### Nets
GND: AD_IC2.5(REF) AD_P7.0 AD_P9.0 AD_P11.0 AD_S3.2(C_1) AD_S3.5(C_2) AD_S4.2(C_1) AD_S4.5(C_2) AD_S5.1(COM_1) AD_S5.3(COM_2)
1st Res (1): AD_IC1.1(NC_1) AD_IC1.2(-IN) AD_R3.1 AD_S1.5(COM_2)
1st Res (2): AD_IC3.1(NC_1) AD_IC3.2(-IN) AD_R6.1 AD_S1.2(COM_1)
2nd Res: AD_IC2.1(RG_1) AD_S2.3(COM)
10 amp (1): AD_R1.1 AD_S1.4(NO_2)
10 amp (2): AD_R5.1 AD_S1.1(NO_1)
10 amp (2nd): AD_R2.1 AD_S2.1(NC)
100 amp (2nd): AD_R4.1 AD_S2.2(NO)
+5V: AD_IC1.7(+VS) AD_IC2.7(+VS) AD_IC3.7(+VS) AD_P4.0
-5V: AD_IC1.4(-VS) AD_IC2.4(-VS) AD_IC3.4(-VS) AD_P5.0 AD_P6.0 AD_P8.0 AD_P10.0
Buffer (1): AD_IC1.6(VOUT) AD_IC2.3(+IN) AD_R1.2 AD_S1.6(NC_2)
Buffer (2): AD_IC2.2(-IN) AD_IC3.6(VOUT) AD_R5.2 AD_S1.3(NC_1)
Rg1: AD_R3.2 AD_S5.4(NO_2)
Rg2: AD_R6.2 AD_S5.2(NO_1)
Vin1: AD_IC1.3(+IN) AD_P1.0 AD_R7.1 AD_R8.1 AD_R9.1 AD_R10.1
Vin2: AD_IC3.3(+IN) AD_P2.0 AD_R11.1 AD_R12.1 AD_R13.1 AD_R14.1
Vout: AD_IC2.6(OUTPUT) AD_P3.0
NetAD_IC2_8: AD_IC2.8(RG_2) AD_R2.2 AD_R4.2
NetAD_R7_2: AD_R7.2 AD_S3.3(0)
NetAD_R8_2: AD_R8.2 AD_S3.1
NetAD_R9_2: AD_R9.2 AD_S3.6(2)
NetAD_R10_2: AD_R10.2 AD_S3.4(3)
NetAD_R11_2: AD_R11.2 AD_S4.3(0)
NetAD_R12_2: AD_R12.2 AD_S4.1
NetAD_R13_2: AD_R13.2 AD_S4.6(2)
NetAD_R14_2: AD_R14.2 AD_S4.4(3)

Not connected (* = marked no-connect by the designer): AD_IC1 5(NC_2) 8(NC_3); AD_IC3 5(NC_2) 8(NC_3)

### Library data of the parts
AD_IC1 AD_IC3 = AD8065ARZ: Integrated Circuit; Manufacturer_Name: Analog Devices; Datasheet Link: https://datasheet.datasheetarchive.com/originals/distributors/Datasheets-1/DSA-2047.pdf; Height: 1.75mm; Manufacturer_Part_Number: AD8065ARZ; Mouser Part Number: 584-AD8065ARZ; Mouser Price/Stock: https://www.mouser.co.uk/ProductDetail/Analog-Devices/AD8065ARZ?qs=%2FtpEQrCGXCyXd34RglYLzQ%3D%3D; Arrow Part Number: AD8065ARZ; Arrow Price/Stock: https://www.arrow.com/en/products/ad8065arz/analog-devices?region=nac; Case: SOIC-8; Mounting Style: SMD/SMT
AD_IC2 = LT1920IS8#PBF: as LIC2 on sheet LTC6268_circuit; Datasheet Link: https://datasheet.datasheetarchive.com/originals/distributors/SFDatasheet-4/sf-00091026.pdf; Height: 1.752mm; Manufacturer_Part_Number: LT1920IS8#PBF; Mouser Part Number: 584-LT1920IS8#PBF; Mouser Price/Stock: https://www.mouser.co.uk/ProductDetail/Analog-Devices/LT1920IS8PBF?qs=ytflclh7QUWOSod6PqfjSg%3D%3D; Arrow Part Number: LT1920IS8#PBF; Arrow Price/Stock: https://www.arrow.com/en/products/lt1920is8pbf/analog-devices?region=nac; Case: SOIC-8; Mounting Style: SMD/SMT
AD_R1 AD_R5 = CRG0805F270R: as LR1 on sheet LTC6268_circuit; Datasheet Link: http://www.te.com/commerce/DocumentDelivery/DDEController?Action=showdoc&DocId=Customer+Drawing%7F1623109%7FBA%7Fpdf%7FEnglish%7FENG_CD_1623109_BA.pdf%7F1623109-1; Height: 0.65mm; Manufacturer_Part_Number: CRG0805F270R; Mouser Part Number: 279-CRG0805F270R; Mouser Price/Stock: https://www.mouser.com/Search/Refine.aspx?Keyword=279-CRG0805F270R; Arrow Part Number: CRG0805F270R; Arrow Price/Stock: https://www.arrow.com/en/products/crg0805f270r/te-connectivity; Case: 0805 (in); Mounting Style: SMD/SMT
AD_R2 = CRG0805F4K7: as LR2 on sheet LTC6268_circuit; Datasheet Link: http://www.te.com/commerce/DocumentDelivery/DDEController?Action=showdoc&DocId=Customer+Drawing%7F1623109%7FBA%7Fpdf%7FEnglish%7FENG_CD_1623109_BA.pdf%7F1623109-1; Height: 0.65mm; Manufacturer_Part_Number: CRG0805F4K7; Mouser Part Number: 279-CRG0805F4K7; Mouser Price/Stock: https://www.mouser.co.uk/ProductDetail/TE-Connectivity-Holsworthy/CRG0805F4K7?qs=VHcS2MTj4gYTCl8bEMP1DQ%3D%3D; Arrow Part Number: CRG0805F4K7; Arrow Price/Stock: https://www.arrow.com/en/products/crg0805f4k7/te-connectivity?region=nac; Case: 0805 (in); Mounting Style: SMD/SMT
AD_R3 AD_R6 = ERJ-HP6F20R0V: as LR3 on sheet LTC6268_circuit; Datasheet Link: http://industrial.panasonic.com/cdbs/www-data/pdf/RDQ0000/ast-ind-151033.pdf; Height: 0.7mm; Manufacturer_Part_Number: ERJ-HP6F20R0V
AD_R4 = CRG0805F330R: as LR4 on sheet LTC6268_circuit; Datasheet Link: http://www.te.com/commerce/DocumentDelivery/DDEController?Action=showdoc&DocId=Customer+Drawing%7F1623109%7FBA%7Fpdf%7FEnglish%7FENG_CD_1623109_BA.pdf%7F1623109-1; Height: 0.65mm; Manufacturer_Part_Number: CRG0805F330R; Mouser Part Number: 279-CRG0805F330R; Mouser Price/Stock: https://www.mouser.co.uk/ProductDetail/TE-Connectivity-Holsworthy/CRG0805F330R?qs=VHcS2MTj4gbLzLJ0%2FI3gmA%3D%3D; Arrow Part Number: CRG0805F330R; Arrow Price/Stock: https://www.arrow.com/en/products/crg0805f330r/te-connectivity?region=nac; Case: 0805 (in); Mounting Style: SMD/SMT
AD_R7 AD_R12 = RH73X2A10GNTN: as LR7 on sheet LTC6268_circuit; Datasheet Link: https://ms.componentsearchengine.com/Datasheets/2/RH73X2A10GNTN.pdf; Height: 0.5mm; Manufacturer_Part_Number: RH73X2A10GNTN; Mouser Part Number: 279-RH73X2A10GNTN; Mouser Price/Stock: https://www.mouser.co.uk/ProductDetail/TE-Connectivity-Holsworthy/RH73X2A10GNTN?qs=ip69W3eHERU7YDrLGqSvdQ%3D%3D; Arrow Part Number: RH73X2A10GNTN; Arrow Price/Stock: https://www.arrow.com/en/products/rh73x2a10gntn/te-connectivity?region=nac; Case: 0805 (in); Mounting Style: SMD/SMT
AD_R8 AD_R11 = RH73X2A50GNTN: as LR8 on sheet LTC6268_circuit; Datasheet Link: http://www.te.com/commerce/DocumentDelivery/DDEController?Action=showdoc&DocId=Data+Sheet%7F1773268%7FA%7Fpdf%7FEnglish%7FENG_DS_1773268_A.pdf%7F1625862-4; Height: 0.5mm; Manufacturer_Part_Number: RH73X2A50GNTN; Mouser Part Number: 279-RH73X2A50GNTN; Mouser Price/Stock: https://www.mouser.co.uk/ProductDetail/TE-Connectivity-Holsworthy/RH73X2A50GNTN?qs=ip69W3eHERVWqEnkYPnkdA%3D%3D; Case: 0805 (in); Mounting Style: SMD/SMT
AD_R9 AD_R14 = RH73H2A100MKTN: as LR9 on sheet LTC6268_circuit; Datasheet Link: http://www.te.com/commerce/DocumentDelivery/DDEController?Action=showdoc&DocId=Data+Sheet%7F1773268%7FA%7Fpdf%7FEnglish%7FENG_DS_1773268_A.pdf%7F1625856-2; Height: 0.5mm; Manufacturer_Part_Number: RH73H2A100MKTN; Mouser Part Number: 279-RH73H2A100MKTN; Mouser Price/Stock: https://www.mouser.co.uk/ProductDetail/TE-Connectivity-Holsworthy/RH73H2A100MKTN?qs=ip69W3eHERW4mrE8f49Fxw%3D%3D; Arrow Part Number: RH73H2A100MKTN; Arrow Price/Stock: https://www.arrow.com/en/products/rh73h2a100mktn/te-connectivity?region=nac; Case: 0805 (in); Mounting Style: SMD/SMT
AD_R10 AD_R13 = RH73W2A1GNTN: as LR10 on sheet LTC6268_circuit; Datasheet Link: https://componentsearchengine.com/Datasheets/2/RH73W2A1GNTN.pdf; Height: 0.5mm; Manufacturer_Part_Number: RH73W2A1GNTN; Mouser Part Number: 279-RH73W2A1GNTN; Mouser Price/Stock: https://www.mouser.co.uk/ProductDetail/TE-Connectivity-Holsworthy/RH73W2A1GNTN?qs=ip69W3eHERV4S8tLXHYflA%3D%3D; Arrow Part Number: RH73W2A1GNTN; Arrow Price/Stock: https://www.arrow.com/en/products/rh73w2a1gntn/te-connectivity?region=nac; Case: 0805 (in); Mounting Style: SMD/SMT
AD_S1 = 452403012014: as LS1 on sheet LTC6268_circuit; Datasheet Link: https://katalog.we-online.de/em/datasheet/452403012014.pdf; Height: 3.3mm; Manufacturer_Part_Number: 452403012014; Mouser Part Number: 710-452403012014; Mouser Price/Stock: https://www.mouser.co.uk/ProductDetail/Wurth-Elektronik/452403012014?qs=DvsTirrhYfOi0QxHyAEO3w%3D%3D
AD_S2 = CS-4-12YA: Switch; Manufacturer_Name: NIDEC COPAL; Datasheet Link: https://www.nidec-copal-electronics.com/j/product/detail/00000197/; Height: 2.6mm; Manufacturer_Part_Number: CS-4-12YA; Mounting Style: SMD/SMT
AD_S3 AD_S4 = CS-7-14TB: as LS3 on sheet LTC6268_circuit; Datasheet Link: https://www.nidec-copal-electronics.com/e/catalog/switch/cs-7.pdf; Height: 4.05mm; Manufacturer_Part_Number: CS-7-14TB; Mounting Style: SMD/SMT
AD_S5 = DS05-127-2-02BK-SMT-TR: Switch; Manufacturer_Name: CUI Devices; Datasheet Link: https://www.cuidevices.com/product/resource/digikeypdf/ds05-127-smt.pdf; Height: 2.6mm; Manufacturer_Part_Number: DS05-127-2-02BK-SMT-TR; Mouser Part Number: 490-DS05127202BK-STR; Mouser Price/Stock: https://www.mouser.co.uk/ProductDetail/CUI-Devices/DS05-127-2-02BK-SMT-TR?qs=wnTfsH77Xs6TIyf6yhikhg%3D%3D; Mounting Style: SMD/SMT

## Nets that join several sheets
GND: LTC6268_circuit (10 pins), Multi_LT_circuit (52 pins), AD8065_circuit (10 pins)
1st Res (1): LTC6268_circuit (LIC1.2 LIC1.4 LR3.1 LS1.5), AD8065_circuit (AD_IC1.1 AD_IC1.2 AD_R3.1 AD_S1.5)
1st Res (2): LTC6268_circuit (LIC3.2 LIC3.4 LR6.1 LS1.2), AD8065_circuit (AD_IC3.1 AD_IC3.2 AD_R6.1 AD_S1.2)
2nd Res: LTC6268_circuit (LIC2.1 LS2.3), AD8065_circuit (AD_IC2.1 AD_S2.3)
10 amp (1): LTC6268_circuit (LR1.1 LS1.4), AD8065_circuit (AD_R1.1 AD_S1.4)
10 amp (2): LTC6268_circuit (LR5.1 LS1.1), AD8065_circuit (AD_R5.1 AD_S1.1)
10 amp (2nd): LTC6268_circuit (LR2.1 LS2.1), AD8065_circuit (AD_R2.1 AD_S2.1)
100 amp (2nd): LTC6268_circuit (LR4.1 LS2.2), AD8065_circuit (AD_R4.1 AD_S2.2)
+5V: LTC6268_circuit (LIC2.7 LP12.0), AD8065_circuit (AD_IC1.7 AD_IC2.7 AD_IC3.7 AD_P4.0)
-5V: LTC6268_circuit (LIC2.4 LP13.0), AD8065_circuit (7 pins)
Buffer (1): LTC6268_circuit (LIC1.6 LIC2.3 LR1.2 LS1.6), AD8065_circuit (AD_IC1.6 AD_IC2.3 AD_R1.2 AD_S1.6)
Buffer (2): LTC6268_circuit (LIC2.2 LIC3.6 LR5.2 LS1.3), AD8065_circuit (AD_IC2.2 AD_IC3.6 AD_R5.2 AD_S1.3)
Rg1: LTC6268_circuit (LR3.2 LS5.4), AD8065_circuit (AD_R3.2 AD_S5.4)
Rg2: LTC6268_circuit (LR6.2 LS5.2), AD8065_circuit (AD_R6.2 AD_S5.2)
Vin1: LTC6268_circuit (6 pins), Multi_LT_circuit (IC1.3 J1.1 P15.0 R10.1), AD8065_circuit (6 pins)
Vin2: LTC6268_circuit (6 pins), Multi_LT_circuit (IC4.3 J1.2 P17.0 R18.1), AD8065_circuit (6 pins)
Vout: LTC6268_circuit (LIC2.6 LP3.0), AD8065_circuit (AD_IC2.6 AD_P3.0)